# Altium project lora_node.PrjPcb
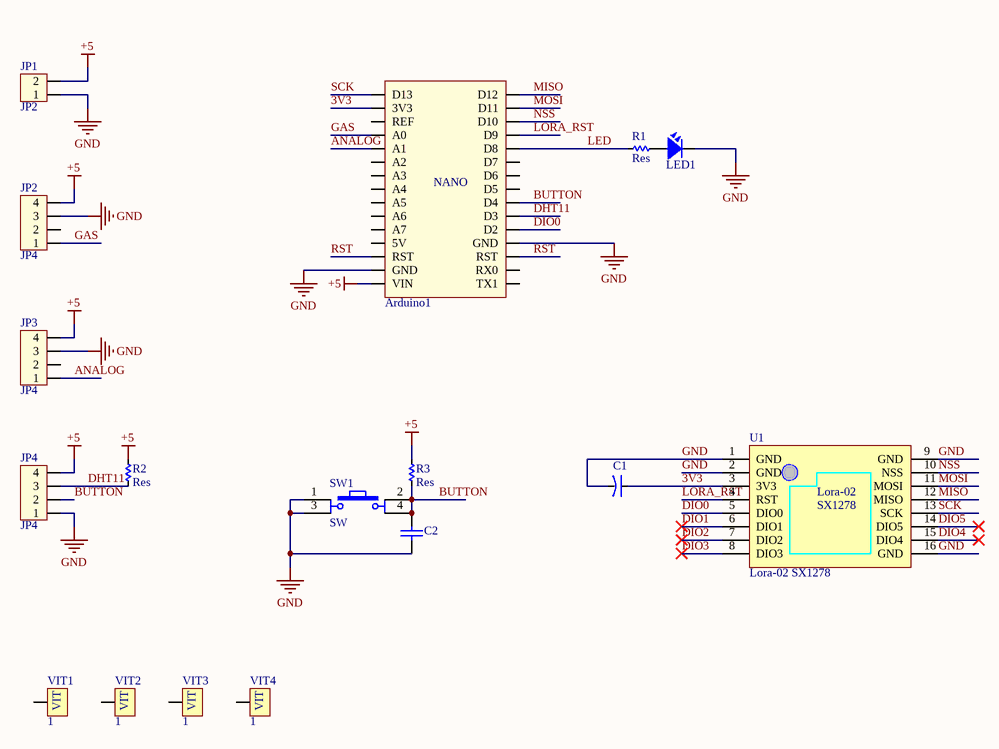
[diagram p0: sch.SchDoc]
1 sheet, 17 parts. Net scope: global (net labels, ports and power ports of the same name join across sheets).
Board file: pcb.PcbDoc

## Sheet sch.SchDoc
size A; SheetNumber: 1; SheetTotal: 1

### Parts
Arduino1  Arduino Nano  [Arduino Nano]  (value not drawn)
C1  CN-ALU-DIP  [CA-ALU-5W]  (value not drawn)
C2  Capacitor Ceramic  [C0805]  (value not drawn)
JP1  JP2  [CON2]
JP2  JP4  [CON4]
JP3  JP4  [CON4]
JP4  JP4  [CON4]
LED1  LED  [LED-3MM-YELLOW]  (value not drawn)
R1  Res  [RES-SMD-1206]
R2  Res  [RES-SMD-1206]
R3  Res  [RES-SMD-1206]
SW1  SW  [SW4]
U1  Lora-02 SX1278  [Lora02-sx1278]
VIT1  1  [VIT]
VIT2  1  [VIT]
VIT3  1  [VIT]
VIT4  1  [VIT]

### Nets
+5: Arduino1.VIN JP1.2 JP2.4 JP3.4 JP4.4 R2.2 R3.1
GND: Arduino1.GND C1.2 C2.1 JP1.1 JP2.3 JP3.3 JP4.1 LED1.2 SW1.1 SW1.3 U1.1(GND) U1.2(GND) U1.9(GND) U1.16(GND)
3V3: Arduino1.3V3 C1.1 U1.3(3V3)
ANALOG: Arduino1.A1 JP3.1
BUTTON: Arduino1.D4 C2.2 JP4.2 R3.2 SW1.2 SW1.4
DHT11: Arduino1.D3 JP4.3 R2.1
DIO0: Arduino1.D2 U1.5(DIO0)
DIO1: U1.6(DIO1)
DIO2: U1.7(DIO2)
DIO3: U1.8(DIO3)
DIO4: U1.15(DIO4)
DIO5: U1.14(DIO5)
GAS: Arduino1.A0 JP2.1
LED: Arduino1.D8 R1.1
LORA_RST: Arduino1.D9 U1.4(RST)
MISO: Arduino1.D12 U1.12(MISO)
MOSI: Arduino1.D11 U1.11(MOSI)
NSS: Arduino1.D10 U1.10(NSS)
RST: Arduino1.RST
SCK: Arduino1.D13 U1.13(SCK)
NetLED1_1: LED1.1 R1.2

Not connected (* = marked no-connect by the designer): Arduino1 5V A2 A3 A4 A5 A6 A7 D5 D6 D7 REF RX0 TX1; JP2 2; JP3 2; VIT1 VIT1(1); VIT2 VIT1(1); VIT3 VIT1(1); VIT4 VIT1(1)

### Notes on the sheet
- (in symbol Arduino Nano) NANO
- (in symbol Lora-02 SX1278) Lora-02; SX1278

### Library data of the parts
Arduino1 = Arduino Nano: Value: Cau 1A
C1 = CN-ALU-DIP: Capacitor (Semiconductor SIM Model); Value: 104; LatestRevisionDate: 17-Jul-2002; LatestRevisionNote: Re-released for DXP Platform.; PackageReference: C1206; Publisher: Altium Limited
C2 = CapSMD: Capacitor; Value: 33p; Published: 8-Jun-2000; LatestRevisionDate: 17-Jul-2002; LatestRevisionNote: Re-released for DXP Platform.; PackageReference: RAD-0.3; Publisher: Altium Limited
JP1 = Con2: Connector 2; Value: Connector 2
JP2-JP4 = Con4: Connector 4; Value: Connector 4
LED1 = LED: LED Single colour Green and Red; Value: LED 3 ly Single Colour
R1-R3 = Res-SMD: Resistor; Manufacturer: Generic Components; Class: Passive; Published: 08/06/2000; Publisher: Altium Hobart Technology Centre
SW1 = SW4: Switch button 4 pin; Value: Button chip 4 pin
VIT1-VIT4 = VIT: Oc Vit